# EAGLE design stateindicator (EAGLE 7.2.0)
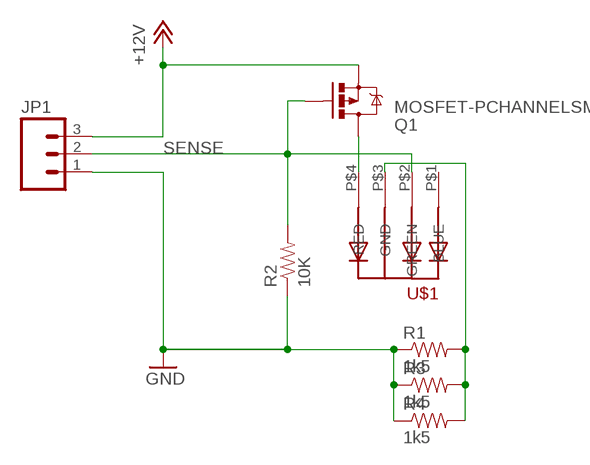
[diagram p0: schematic, sheet 1]

## Parts
JP1  M03POLAR_LOCK  [MOLEX-1X3_LOCK]
Q1  MOSFET-PCHANNELSMD  [SOT23-3]
R1  1k5  RESISTOR0603-RES  [0603-RES]
R2  10K  RESISTOR0603-RES  [0603-RES]
R3  1k5  RESISTOR0603-RES  [0603-RES]
R4  1k5  RESISTOR0603-RES  [0603-RES]
U$1  5MMRGBLED  [LED5MMRGB]

## Nets
+12V: JP1.3 Q1.2(S)
GND: JP1.1 R1.1 R2.1 R3.1 R4.1
N$1: R1.2 R3.2 R4.2 U$1.P$3(GND)
N$2: Q1.3(D) U$1.P$4(RED)
SENSE: JP1.2 Q1.1(G) R2.2 U$1.P$2(GREEN)
Unconnected: U$1.P$1(BLUE)

## Library data of the parts
JP1 = SparkFun:M03: Header 3 Standard 3-pin 0.1" header. Use with straight break away headers (SKU : PRT-00116), right angle break away headers (PRT-00553), swiss pins (PRT-00743), machine pins (PRT-00117), and female headers (PRT-00115). Molex polarized connector foot print use with SKU : PRT-08232 with associated crimp pins and housings.
Q1 = SparkFun-DiscreteSemi:MOSFET-PCHANNEL: Generic PMOSFET
R1-R4 = SparkFun:RESISTOR: Resistor Basic schematic elements and footprints for 0603, 1206, and PTH 1/10th watt (small) resistors.
U$1 = led_rgb:5MMRGBLED

## Board
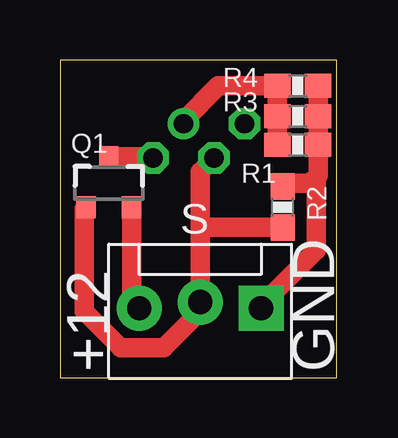
[diagram p1: board, top side]
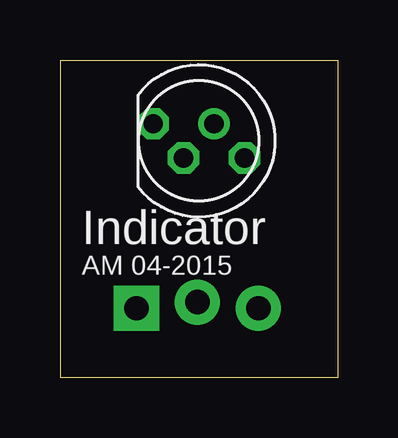
[diagram p2: board, bottom side, seen from below]

Size 11.53 x 13.24 mm. Coordinates in mm from the lower left corner, seen from the top.
Outline: 0,0 11.53,0 11.53,13.24 0,13.24 0,0
Copper layers (1*16): Top 0.035mm / dielectric 1.5mm / Bottom 0.035mm
Design rules "mill *": minimum track width 6mil, minimum drill 12mil, track to track 6mil, track to pad 6mil, pad to pad 6mil, via to via 6mil, smd to smd 0mil, copper to edge 10mil, drill to drill 10mil, minimum pad ring 10mil, minimum via ring 6mil, stop-mask expansion 2mil, vias tented up to drill 100mil, thermal gap 10mil

### Footprints (pad centres in the part's own frame; a part is rotated, then mirrored left to right if it is on the bottom)
MOLEX-1X3_LOCK = drill 1.016 pad 1.88 square: 1 0,0.127 | drill 1.016 pad 1.88: 2 2.54,-0.127; 3 5.08,0.127
SOT23-3 = smd 0.8 x 0.9: 1 -0.95,-1; 2 0.95,-1; 3 0,1.1
0603-RES = smd 1.1 x 1: 1 -0.85,0; 2 0.85,0
LED5MMRGB = drill 0.8 pad 0.813 octagon: P$1 -1.905,0.714; P$2 -0.635,-0.714; P$4 1.905,-0.714 | drill 0.8 pad 0.813: P$3 0.635,0.714

### Placement (x,y rotation side)
JP1  8.38,3.02 180 top
Q1  2.03,8.1 0 top
R1  9.91,9.7 180 top
R2  9.27,7.11 270 top
R3  9.91,10.9 180 top
R4  9.91,12.17 180 top
U$1  5.78,9.87 0 bottom

### Tracks (layer width: path | path; a pad name or v marks a point on that pad's centre or on a via)
+12V
  Top 0.813: JP1.3 2.98,2.9 Q1.2
GND
  Top 0.813: JP1.1 8.38,3.02 10.67,5.31 10.67,8.1 10.41,8.1 | 10.41,8.1 9.41,8.1 R2.1 | R4.1 R3.1 R1.1 10.76,8.44 10.41,8.1
N$1
  Top 0.813: U$1.P$3 5.15,10.71 6.6,12.17 R4.2 R3.2 R1.2
N$2
  Top 0.813: Q1.3 3.83,9.2 U$1.P$4
SENSE
  Top 0.813: Q1.1 1.02,7.04 1.02,2.77 2.54,1.24 4.32,1.24 5.84,2.77 JP1.2 5.84,6.07 | 5.84,6.07 5.84,8.58 U$1.P$2 | R2.2 6.03,6.26 5.84,6.07

### Text on the board
tNames: S | +12 | GND
bNames: Indicator | AM 04-2015